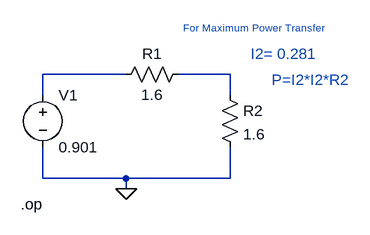
[diagram p0: schematic Draft5.asc]
Draft5.asc, the LTspice schematic file:
Version 4
SHEET 1 880 680
WIRE 32 48 -96 48
WIRE 192 48 112 48
WIRE -96 80 -96 48
WIRE 192 80 192 48
WIRE -96 208 -96 160
WIRE 32 208 -96 208
WIRE 192 208 192 160
WIRE 192 208 32 208
WIRE 32 224 32 208
FLAG 32 224 0
SYMBOL res 128 32 R90
WINDOW 0 0 56 VBottom 2
WINDOW 3 32 56 VTop 2
SYMATTR InstName R1
SYMATTR Value 1.6
SYMBOL voltage -96 64 R0
WINDOW 123 0 0 Left 0
WINDOW 39 0 0 Left 0
SYMATTR InstName V1
SYMATTR Value 0.901
SYMBOL res 176 64 R0
SYMATTR InstName R2
SYMATTR Value 1.6
TEXT 120 -24 Left 1 ;For Maximum Power Transfer
TEXT -130 248 Left 2 !.op
TEXT 224 16 Left 2 ;I2= 0.281
TEXT 256 56 Left 2 ;P=I2*I2*R2

The netlist it stands for:
* Draft5.asc
R1 N002 N001 1.6
V1 N001 0 0.901
R2 N002 0 1.6
* For Maximum Power Transfer
.op
* I2= 0.281
* P=I2*I2*R2
.backanno
.end